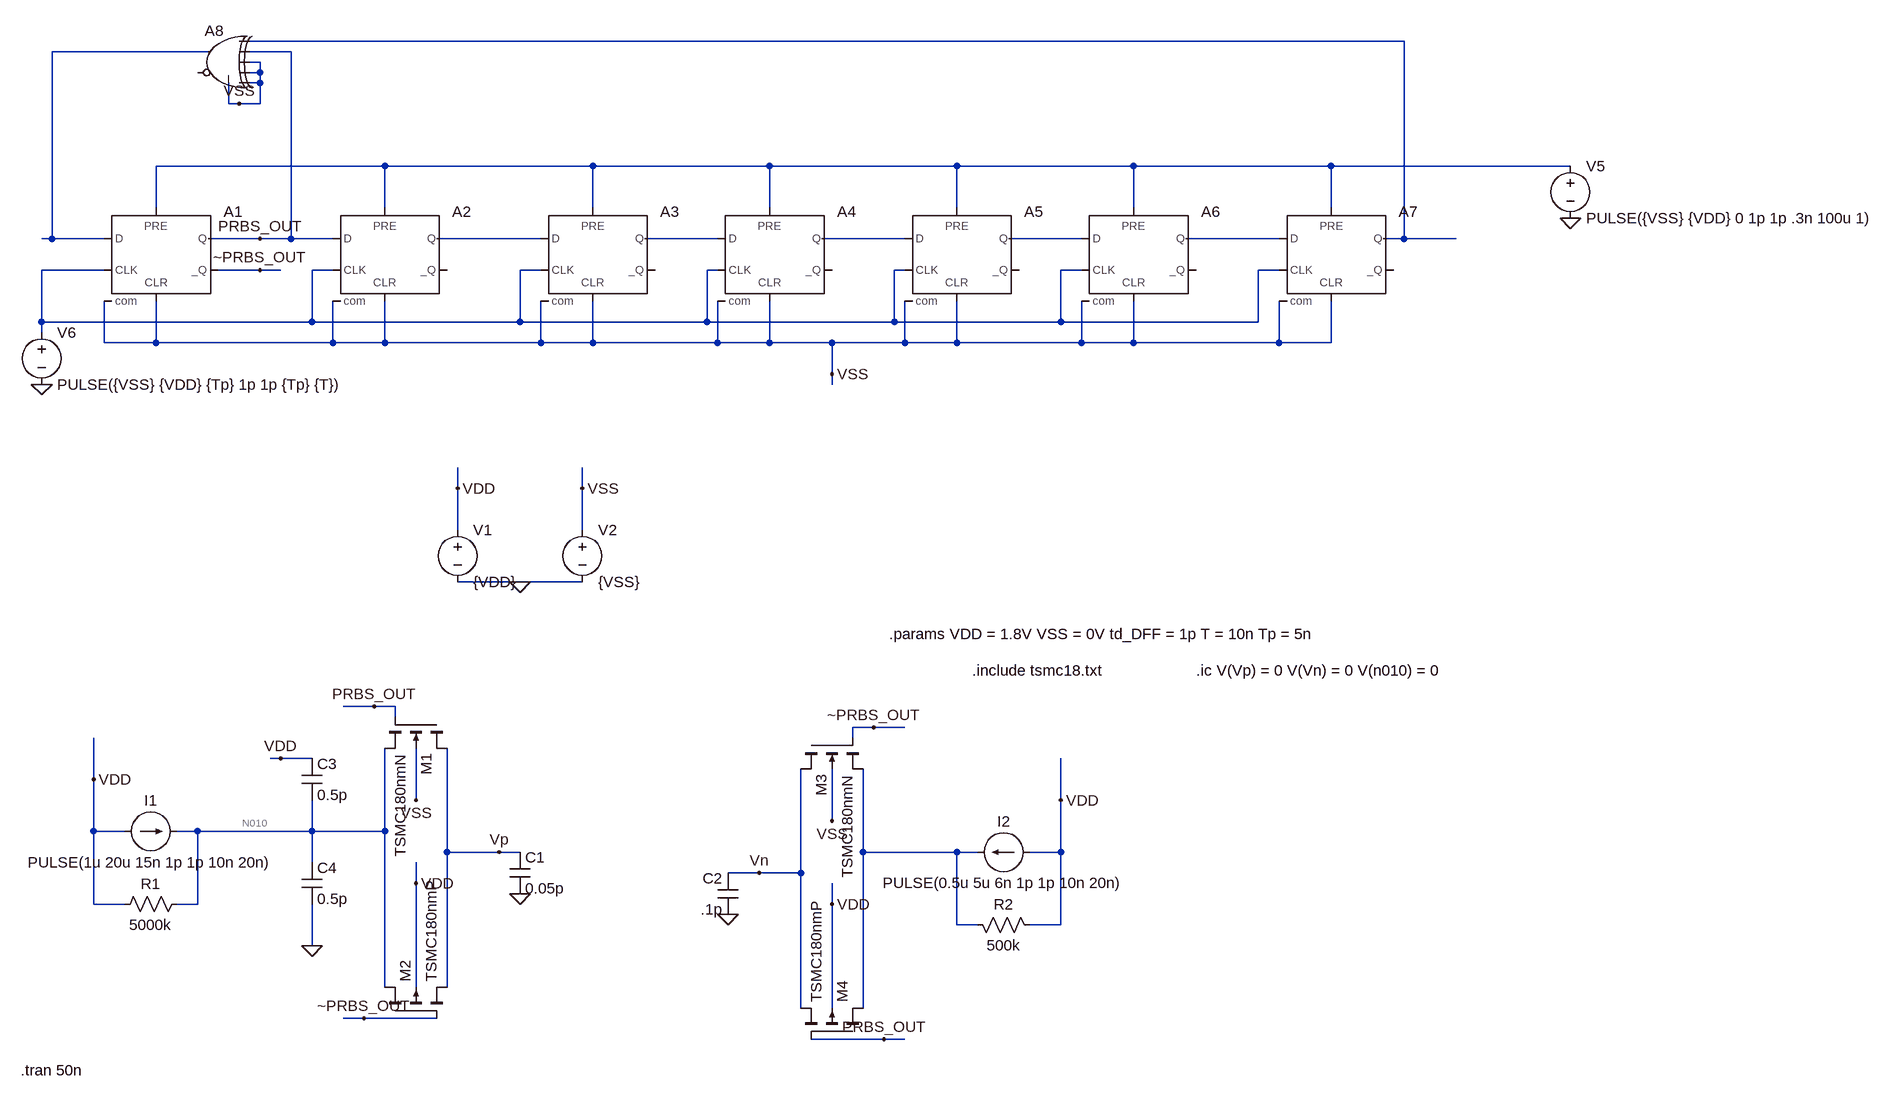
[diagram p0: schematic Current_Mode_Integrator.asc]
Current_Mode_Integrator.asc, the LTspice schematic file:
Version 4
SHEET 1 2060 688
WIRE 1280 -912 -496 -912
WIRE -560 -896 -800 -896
WIRE -432 -896 -496 -896
WIRE -480 -880 -496 -880
WIRE -480 -864 -480 -880
WIRE -480 -864 -496 -864
WIRE -480 -848 -480 -864
WIRE -480 -848 -496 -848
WIRE -528 -816 -528 -848
WIRE -512 -816 -528 -816
WIRE -480 -816 -480 -848
WIRE -480 -816 -512 -816
WIRE -288 -720 -640 -720
WIRE 32 -720 -288 -720
WIRE 304 -720 32 -720
WIRE 592 -720 304 -720
WIRE 864 -720 592 -720
WIRE 1168 -720 864 -720
WIRE 1536 -720 1168 -720
WIRE -640 -656 -640 -720
WIRE -288 -656 -288 -720
WIRE 32 -656 32 -720
WIRE 304 -656 304 -720
WIRE 592 -656 592 -720
WIRE 864 -656 864 -720
WIRE 1168 -656 1168 -720
WIRE -800 -608 -800 -896
WIRE -800 -608 -816 -608
WIRE -720 -608 -800 -608
WIRE -480 -608 -560 -608
WIRE -432 -608 -432 -896
WIRE -432 -608 -480 -608
WIRE -368 -608 -432 -608
WIRE -48 -608 -208 -608
WIRE 224 -608 112 -608
WIRE 512 -608 384 -608
WIRE 784 -608 672 -608
WIRE 1088 -608 944 -608
WIRE 1280 -608 1280 -912
WIRE 1280 -608 1248 -608
WIRE 1360 -608 1280 -608
WIRE -720 -560 -816 -560
WIRE -480 -560 -544 -560
WIRE -448 -560 -480 -560
WIRE -368 -560 -400 -560
WIRE -48 -560 -80 -560
WIRE 224 -560 208 -560
WIRE 512 -560 496 -560
WIRE 784 -560 752 -560
WIRE 1088 -560 1056 -560
WIRE -816 -480 -816 -560
WIRE -400 -480 -400 -560
WIRE -400 -480 -816 -480
WIRE -80 -480 -80 -560
WIRE -80 -480 -400 -480
WIRE 208 -480 208 -560
WIRE 208 -480 -80 -480
WIRE 496 -480 496 -560
WIRE 496 -480 208 -480
WIRE 752 -480 752 -560
WIRE 752 -480 496 -480
WIRE 1056 -480 1056 -560
WIRE 1056 -480 752 -480
WIRE -816 -464 -816 -480
WIRE -720 -448 -720 -512
WIRE -640 -448 -640 -512
WIRE -640 -448 -720 -448
WIRE -368 -448 -368 -512
WIRE -368 -448 -640 -448
WIRE -288 -448 -288 -512
WIRE -288 -448 -368 -448
WIRE -48 -448 -48 -512
WIRE -48 -448 -288 -448
WIRE 32 -448 32 -512
WIRE 32 -448 -48 -448
WIRE 224 -448 224 -512
WIRE 224 -448 32 -448
WIRE 304 -448 304 -512
WIRE 304 -448 224 -448
WIRE 400 -448 304 -448
WIRE 512 -448 512 -512
WIRE 512 -448 400 -448
WIRE 592 -448 592 -512
WIRE 592 -448 512 -448
WIRE 784 -448 784 -512
WIRE 784 -448 592 -448
WIRE 864 -448 864 -512
WIRE 864 -448 784 -448
WIRE 1088 -448 1088 -512
WIRE 1088 -448 864 -448
WIRE 1168 -448 1168 -512
WIRE 1168 -448 1088 -448
WIRE 400 -400 400 -448
WIRE 400 -384 400 -400
WIRE -176 -224 -176 -256
WIRE 16 -224 16 -256
WIRE -176 -160 -176 -224
WIRE 16 -160 16 -224
WIRE -80 -80 -176 -80
WIRE 16 -80 -80 -80
WIRE -304 112 -352 112
WIRE -272 112 -304 112
WIRE -272 128 -272 112
WIRE 464 144 432 144
WIRE 512 144 464 144
WIRE 432 160 432 144
WIRE -448 192 -464 192
WIRE -400 192 -448 192
WIRE -736 224 -736 160
WIRE -240 256 -240 176
WIRE 752 256 752 192
WIRE 400 288 400 208
WIRE -736 304 -736 224
WIRE -688 304 -736 304
WIRE -576 304 -608 304
WIRE -400 304 -400 256
WIRE -400 304 -576 304
WIRE -288 304 -288 176
WIRE -288 304 -400 304
WIRE -192 336 -192 176
WIRE -112 336 -192 336
WIRE -80 336 -112 336
WIRE 448 336 448 208
WIRE 592 336 448 336
WIRE 624 336 592 336
WIRE 752 336 752 256
WIRE 752 336 704 336
WIRE -400 352 -400 304
WIRE 288 368 240 368
WIRE 352 368 352 208
WIRE 352 368 288 368
WIRE -240 384 -240 352
WIRE -736 416 -736 304
WIRE -688 416 -736 416
WIRE -576 416 -576 304
WIRE -576 416 -608 416
WIRE 400 416 400 384
WIRE 592 448 592 336
WIRE 624 448 592 448
WIRE 752 448 752 336
WIRE 752 448 704 448
WIRE -400 480 -400 416
WIRE -288 544 -288 304
WIRE -240 544 -240 384
WIRE -192 544 -192 336
WIRE 352 576 352 368
WIRE 400 576 400 416
WIRE 448 576 448 336
WIRE -320 592 -352 592
WIRE -208 592 -320 592
WIRE 480 624 368 624
WIRE 512 624 480 624
FLAG -240 384 VDD
FLAG -240 256 VSS
FLAG -80 400 0
FLAG -80 -80 0
FLAG -176 -224 VDD
FLAG 16 -224 VSS
FLAG 1536 -640 0
FLAG -816 -384 0
FLAG -512 -816 VSS
FLAG 400 -400 VSS
FLAG -480 -608 PRBS_OUT
FLAG -480 -560 ~PRBS_OUT
FLAG -304 112 PRBS_OUT
FLAG -320 592 ~PRBS_OUT
FLAG -736 224 VDD
FLAG 400 416 VDD
FLAG 400 288 VSS
FLAG 240 432 0
FLAG 464 144 ~PRBS_OUT
FLAG 480 624 PRBS_OUT
FLAG 752 256 VDD
FLAG -112 336 Vp
FLAG 288 368 Vn
FLAG -400 480 0
FLAG -448 192 VDD
SYMBOL cap -96 336 R0
SYMATTR InstName C1
SYMATTR Value 0.05p
SYMBOL nmos4 -192 128 R90
SYMATTR InstName M1
SYMATTR Value TSMC180nmN
SYMATTR Value2 l=.5u w=2u
SYMBOL pmos4 -288 592 R270
SYMATTR InstName M2
SYMATTR Value TSMC180nmP
SYMATTR Value2 l=.5u w=6u
SYMBOL voltage -176 -176 R0
WINDOW 123 0 0 Left 0
WINDOW 39 0 0 Left 0
SYMATTR InstName V1
SYMATTR Value {VDD}
SYMBOL voltage 16 -176 R0
WINDOW 123 0 0 Left 0
WINDOW 39 0 0 Left 0
SYMATTR InstName V2
SYMATTR Value {VSS}
SYMBOL Digital\\dflop -640 -656 R0
SYMATTR InstName A1
SYMATTR SpiceLine Trise = 1p Tfall = 1p Td = td_DFF
SYMATTR Value2 Vhigh = 1.8 Vlow = 0
SYMBOL Digital\\dflop -288 -656 R0
SYMATTR InstName A2
SYMATTR SpiceLine Trise = 1p Tfall = 1p Td = td_DFF
SYMATTR Value2 Vhigh = 1.8 Vlow = 0
SYMBOL Digital\\dflop 32 -656 R0
SYMATTR InstName A3
SYMATTR SpiceLine Trise = 1p Tfall = 1p Td = td_DFF
SYMATTR Value2 Vhigh = 1.8 Vlow = 0
SYMBOL Digital\\dflop 304 -656 R0
SYMATTR InstName A4
SYMATTR SpiceLine Trise = 1p Tfall = 1p Td = td_DFF
SYMATTR Value2 Vhigh = 1.8 Vlow = 0
SYMBOL Digital\\dflop 592 -656 R0
SYMATTR InstName A5
SYMATTR SpiceLine Trise = 1p Tfall = 1p Td = td_DFF
SYMATTR Value2 Vhigh = 1.8 Vlow = 0
SYMBOL Digital\\dflop 864 -656 R0
SYMATTR InstName A6
SYMATTR SpiceLine Trise = 1p Tfall = 1p Td = td_DFF
SYMATTR Value2 Vhigh = 1.8 Vlow = 0
SYMBOL Digital\\dflop 1168 -656 R0
SYMATTR InstName A7
SYMATTR SpiceLine Trise = 1p Tfall = 1p Td = td_DFF
SYMATTR Value2 Vhigh = 1.8 Vlow = 0
SYMBOL Digital\\xor -544 -944 M0
SYMATTR InstName A8
SYMATTR Value2 Vhigh = 1.8 Vlow = 0
SYMBOL voltage 1536 -736 R0
WINDOW 123 0 0 Left 0
WINDOW 39 0 0 Left 0
SYMATTR InstName V5
SYMATTR Value PULSE({VSS} {VDD} 0 1p 1p .3n 100u 1)
SYMBOL voltage -816 -480 R0
WINDOW 123 0 0 Left 0
WINDOW 39 0 0 Left 0
SYMATTR InstName V6
SYMATTR Value PULSE({VSS} {VDD} {Tp} 1p 1p {Tp} {T})
SYMBOL current -688 304 R270
WINDOW 0 32 40 VTop 2
WINDOW 3 -32 40 VBottom 2
WINDOW 123 0 0 Left 0
WINDOW 39 0 0 Left 0
SYMATTR InstName I1
SYMATTR Value PULSE(1u 20u 15n 1p 1p 10n 20n)
SYMBOL res -592 400 R90
WINDOW 0 0 56 VBottom 2
WINDOW 3 32 56 VTop 2
SYMATTR InstName R1
SYMATTR Value 5000k
SYMBOL cap 256 368 M0
SYMATTR InstName C2
SYMATTR Value .1p
SYMBOL nmos4 352 160 M90
SYMATTR InstName M3
SYMATTR Value TSMC180nmN
SYMATTR Value2 l=1u w=3u
SYMBOL pmos4 448 624 M270
SYMATTR InstName M4
SYMATTR Value TSMC180nmP
SYMATTR Value2 l=1u w=3u
SYMBOL current 704 336 M270
WINDOW 0 32 40 VTop 2
WINDOW 3 -32 40 VBottom 2
WINDOW 123 0 0 Left 0
WINDOW 39 0 0 Left 0
SYMATTR InstName I2
SYMATTR Value PULSE(0.5u 5u 6n 1p 1p 10n 20n)
SYMBOL res 608 432 M90
WINDOW 0 0 56 VBottom 2
WINDOW 3 32 56 VTop 2
SYMATTR InstName R2
SYMATTR Value 500k
SYMBOL cap -416 192 R0
SYMATTR InstName C3
SYMATTR Value 0.5p
SYMBOL cap -416 352 R0
SYMATTR InstName C4
SYMATTR Value 0.5p
TEXT 616 56 Left 2 !.include tsmc18.txt
TEXT 488 0 Left 2 !.params VDD = 1.8V VSS = 0V td_DFF = 1p T = 10n Tp = 5n
TEXT -848 672 Left 2 !.tran 50n
TEXT 960 56 Left 2 !.ic V(Vp) = 0 V(Vn) = 0 V(n010) = 0

The netlist it stands for:
* Current_Mode_Integrator.asc
C1 Vp 0 0.05p
M1 Vp PRBS_OUT N010 VSS TSMC180nmN l=.5u w=2u
M2 N010 ~PRBS_OUT Vp VDD TSMC180nmP l=.5u w=6u
V1 VDD 0 {VDD}
V2 VSS 0 {VSS}
A1 N002 VSS N009 N003 VSS ~PRBS_OUT PRBS_OUT VSS DFLOP Vhigh = 1.8 Vlow = 0 Trise = 1p Tfall = 1p Td = td_DFF
A2 PRBS_OUT VSS N009 N003 VSS VSS N004 VSS DFLOP Vhigh = 1.8 Vlow = 0 Trise = 1p Tfall = 1p Td = td_DFF
A3 N004 VSS N009 N003 VSS VSS N005 VSS DFLOP Vhigh = 1.8 Vlow = 0 Trise = 1p Tfall = 1p Td = td_DFF
A4 N005 VSS N009 N003 VSS VSS N006 VSS DFLOP Vhigh = 1.8 Vlow = 0 Trise = 1p Tfall = 1p Td = td_DFF
A5 N006 VSS N009 N003 VSS VSS N007 VSS DFLOP Vhigh = 1.8 Vlow = 0 Trise = 1p Tfall = 1p Td = td_DFF
A6 N007 VSS N009 N003 VSS VSS N008 VSS DFLOP Vhigh = 1.8 Vlow = 0 Trise = 1p Tfall = 1p Td = td_DFF
A7 N008 VSS N009 N003 VSS VSS N001 VSS DFLOP Vhigh = 1.8 Vlow = 0 Trise = 1p Tfall = 1p Td = td_DFF
A8 N001 PRBS_OUT VSS VSS VSS VSS N002 VSS XOR Vhigh = 1.8 Vlow = 0
V5 N003 0 PULSE({VSS} {VDD} 0 1p 1p .3n 100u 1)
V6 N009 0 PULSE({VSS} {VDD} {Tp} 1p 1p {Tp} {T})
I1 VDD N010 PULSE(1u 20u 15n 1p 1p 10n 20n)
R1 N010 VDD 5000k
C2 Vn 0 .1p
M3 Vn ~PRBS_OUT N011 VSS TSMC180nmN l=1u w=3u
M4 N011 PRBS_OUT Vn VDD TSMC180nmP l=1u w=3u
I2 VDD N011 PULSE(0.5u 5u 6n 1p 1p 10n 20n)
R2 N011 VDD 500k
C3 VDD N010 0.5p
C4 N010 0 0.5p
.model NMOS NMOS
.model PMOS PMOS
.lib standard.mos
.include tsmc18.txt
.params VDD = 1.8V VSS = 0V td_DFF = 1p T = 10n Tp = 5n
.tran 50n
.ic V(Vp) = 0 V(Vn) = 0 V(n010) = 0
.backanno
.end